# Altium schematic sheet main.SchDoc
size A4
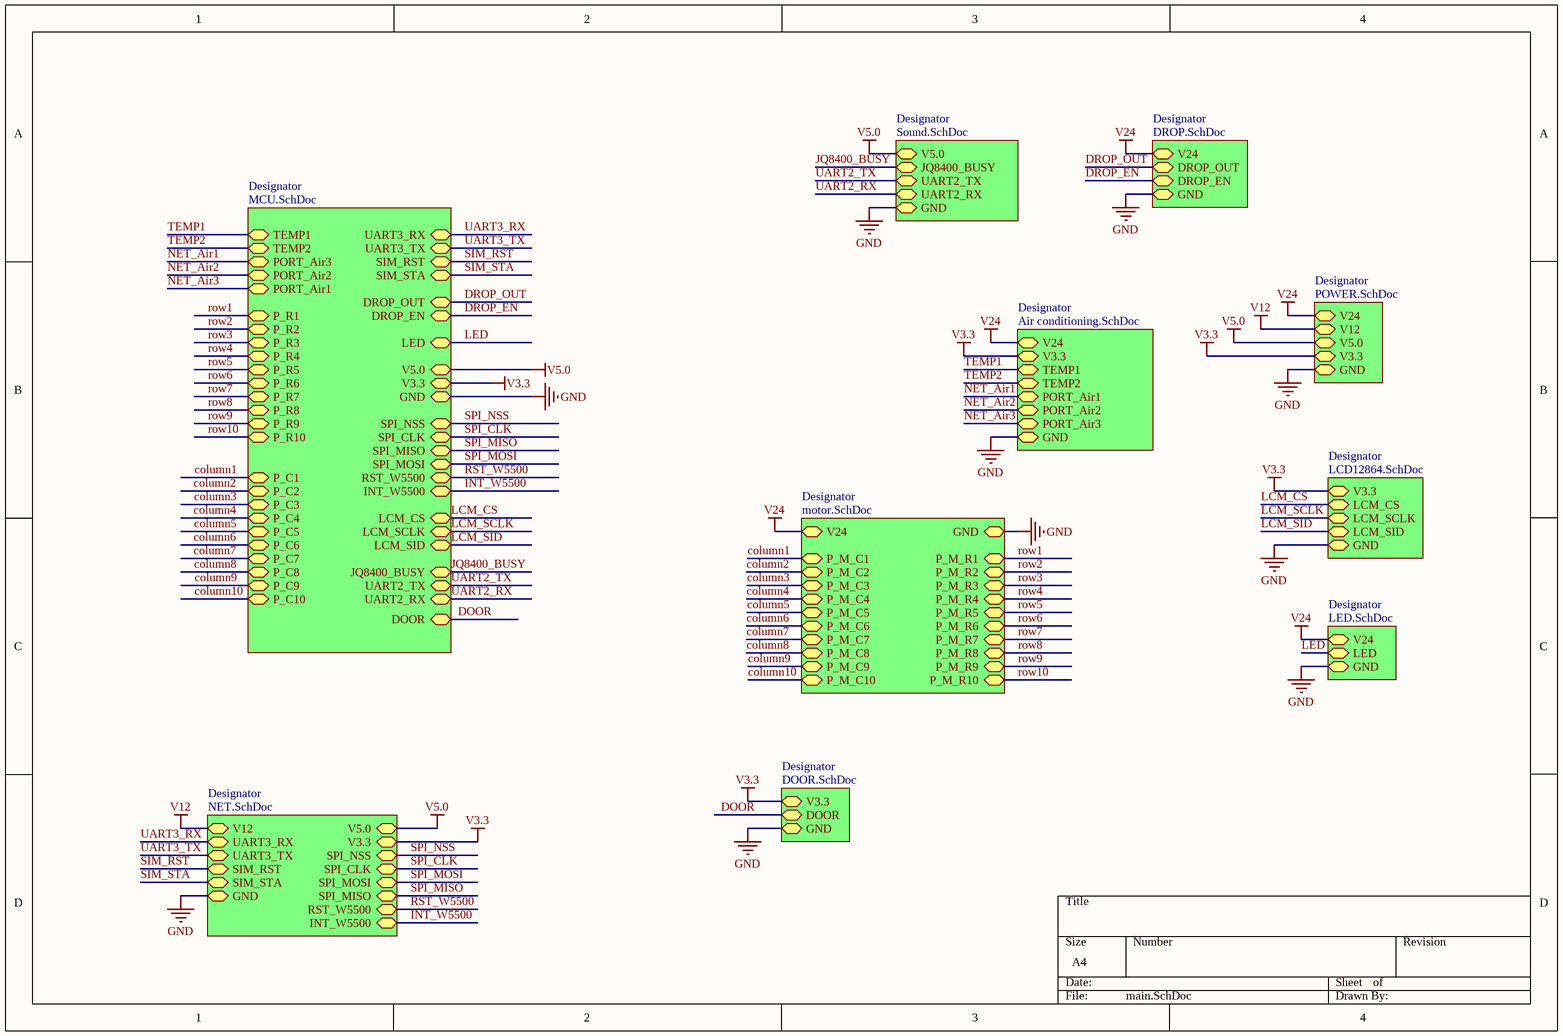
[diagram p0: main.SchDoc]

## Sub-sheets
Designator = NET.SchDoc: UART3_RX, GND, UART3_TX, V12, SIM_RST, SIM_STA, V5.0, SPI_CLK, SPI_NSS, SPI_MOSI, RST_W5500, SPI_MISO, V3.3, INT_W5500
Designator = motor.SchDoc: V24, GND, P_M_R1, P_M_R3, P_M_R9, P_M_R5, P_M_R6, P_M_R8, P_M_R7, P_M_R10, P_M_R4, P_M_R2, P_M_C6, P_M_C1, P_M_C5, P_M_C9, P_M_C2, P_M_C4, P_M_C3, P_M_C7, P_M_C8, P_M_C10
Designator = Air conditioning.SchDoc: GND, V24, TEMP1, V3.3, TEMP2, PORT_Air2, PORT_Air1, PORT_Air3
Designator = DROP.SchDoc: DROP_EN, V24, GND, DROP_OUT
Designator = LED.SchDoc: LED, V24, GND
Designator = MCU.SchDoc: V5.0, GND, V3.3, TEMP1, TEMP2, DROP_EN, DROP_OUT, JQ8400_BUSY, UART2_RX, UART2_TX, SIM_RST, SIM_STA, UART3_RX, UART3_TX, LED, LCM_SID, LCM_SCLK, LCM_CS, SPI_NSS, SPI_MISO, RST_W5500, SPI_MOSI, INT_W5500, SPI_CLK, PORT_Air3, PORT_Air2, PORT_Air1, P_R4, P_R5, P_R6, P_R7, P_R8, P_R9, P_R10, P_R1, P_R2, P_R3, P_C1, P_C2, P_C3, P_C4, P_C5, P_C6, P_C7, P_C8, P_C9, P_C10, DOOR
Designator = POWER.SchDoc: V5.0, V3.3, GND, V24, V12
Designator = Sound.SchDoc: JQ8400_BUSY, UART2_TX, UART2_RX, GND, V5.0
Designator = LCD12864.SchDoc: LCM_CS, LCM_SCLK, GND, LCM_SID, V3.3
Designator = DOOR.SchDoc: V3.3, DOOR, GND

## Nets
GND: sheet Designator/GND, sheet Designator/GND, sheet Designator/GND, sheet Designator/GND, sheet Designator/GND, sheet Designator/GND, sheet Designator/GND, sheet Designator/GND, sheet Designator/GND, sheet Designator/GND
V3.3: sheet Designator/V3.3, sheet Designator/V3.3, sheet Designator/V3.3, sheet Designator/V3.3, sheet Designator/V3.3, sheet Designator/V3.3
V5.0: sheet Designator/V5.0, sheet Designator/V5.0, sheet Designator/V5.0, sheet Designator/V5.0
V12: sheet Designator/V12, sheet Designator/V12
V24: sheet Designator/V24, sheet Designator/V24, sheet Designator/V24, sheet Designator/V24, sheet Designator/V24
column1: sheet Designator/P_M_C1, sheet Designator/P_C1
column2: sheet Designator/P_M_C2, sheet Designator/P_C2
column3: sheet Designator/P_M_C3, sheet Designator/P_C3
column4: sheet Designator/P_M_C4, sheet Designator/P_C4
column5: sheet Designator/P_M_C5, sheet Designator/P_C5
column6: sheet Designator/P_M_C6, sheet Designator/P_C6
column7: sheet Designator/P_M_C7, sheet Designator/P_C7
column8: sheet Designator/P_M_C8, sheet Designator/P_C8
column9: sheet Designator/P_M_C9, sheet Designator/P_C9
column10: sheet Designator/P_M_C10, sheet Designator/P_C10
DOOR: sheet Designator/DOOR, sheet Designator/DOOR
DROP_EN: sheet Designator/DROP_EN, sheet Designator/DROP_EN
DROP_OUT: sheet Designator/DROP_OUT, sheet Designator/DROP_OUT
INT_W5500: sheet Designator/INT_W5500, sheet Designator/INT_W5500
JQ8400_BUSY: sheet Designator/JQ8400_BUSY, sheet Designator/JQ8400_BUSY
LCM_CS: sheet Designator/LCM_CS, sheet Designator/LCM_CS
LCM_SCLK: sheet Designator/LCM_SCLK, sheet Designator/LCM_SCLK
LCM_SID: sheet Designator/LCM_SID, sheet Designator/LCM_SID
LED: sheet Designator/LED, sheet Designator/LED
NET_Air1: sheet Designator/PORT_Air1, sheet Designator/PORT_Air3
NET_Air2: sheet Designator/PORT_Air2, sheet Designator/PORT_Air2
NET_Air3: sheet Designator/PORT_Air3, sheet Designator/PORT_Air1
row1: sheet Designator/P_M_R1, sheet Designator/P_R1
row2: sheet Designator/P_M_R2, sheet Designator/P_R2
row3: sheet Designator/P_M_R3, sheet Designator/P_R3
row4: sheet Designator/P_M_R4, sheet Designator/P_R4
row5: sheet Designator/P_M_R5, sheet Designator/P_R5
row6: sheet Designator/P_M_R6, sheet Designator/P_R6
row7: sheet Designator/P_M_R7, sheet Designator/P_R7
row8: sheet Designator/P_M_R8, sheet Designator/P_R8
row9: sheet Designator/P_M_R9, sheet Designator/P_R9
row10: sheet Designator/P_M_R10, sheet Designator/P_R10
RST_W5500: sheet Designator/RST_W5500, sheet Designator/RST_W5500
SIM_RST: sheet Designator/SIM_RST, sheet Designator/SIM_RST
SIM_STA: sheet Designator/SIM_STA, sheet Designator/SIM_STA
SPI_CLK: sheet Designator/SPI_CLK, sheet Designator/SPI_CLK
SPI_MISO: sheet Designator/SPI_MISO, sheet Designator/SPI_MISO
SPI_MOSI: sheet Designator/SPI_MOSI, sheet Designator/SPI_MOSI
SPI_NSS: sheet Designator/SPI_NSS, sheet Designator/SPI_NSS
TEMP1: sheet Designator/TEMP1, sheet Designator/TEMP1
TEMP2: sheet Designator/TEMP2, sheet Designator/TEMP2
UART2_RX: sheet Designator/UART2_RX, sheet Designator/UART2_RX
UART2_TX: sheet Designator/UART2_TX, sheet Designator/UART2_TX
UART3_RX: sheet Designator/UART3_RX, sheet Designator/UART3_RX
UART3_TX: sheet Designator/UART3_TX, sheet Designator/UART3_TX